# Altium schematic sheet RFA433.SchDoc
size 420 x 297 mm; SheetNumber: 1; SheetTotal: 1
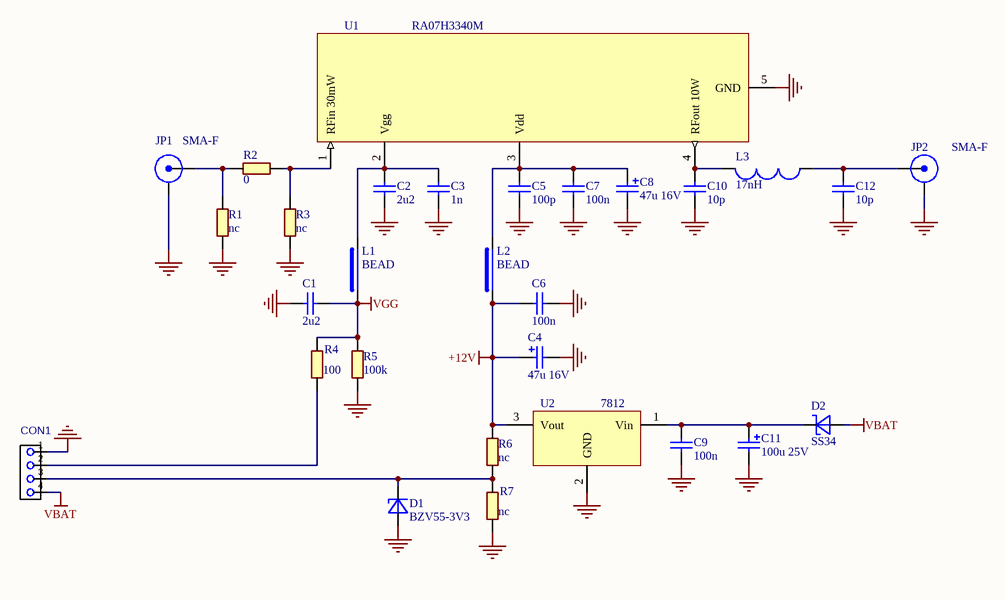
[diagram p0: RFA433.SchDoc]

## Parts
C1  2u2  [C-0805]
C2  2u2  [C-0805]
C3  1n  [C-0805]
C4  47u 16V  [ECAPSMD6377]
C5  100p  [C-0805]
C6  100n  [C-0805]
C7  100n  [C-0805]
C8  47u 16V  [ECAPSMD6377]
C9  100n  [C-0805]
C10  10p  [C-0805]
C11  100u 25V  [ECAPSMD6377]
C12  10p  [C-0805]
CON1  KLS2-301-5.0-04P  [KLS2-301-5.0-04P]  (value not drawn)
D1  BZV55-3V3  [SOD-80_NUM]
D2  SS34  [D_SMC]
JP1  SMA-F  [AMPHENOL_132357-11]
JP2  SMA-F  [AMPHENOL_132357-11]
L1  BEAD  [R-1206]
L2  BEAD  [R-1206]
L3  17nH  [2.75TD3.0W0.7_SMD]
R1  nc  [R-0805]
R2  0  [R-0805]
R3  nc  [R-0805]
R4  100  [R-0805]
R5  100k  [R-0805]
R6  nc  [R-0805]
R7  nc  [R-0805]
U1  RA07H3340M  [H46]
U2  7812  [TO-220/HOR_FLAT]

## Nets
+12V: C4.1 C6.1 L2.1 R6.2 U2.3(Vout)
GND: C1.1 C2.2 C3.2 C4.2 C5.2 C6.2 C7.2 C8.2 C9.1 C10.2 C11.2 C12.2 CON1.1 D1.1 JP1.2(Y) JP2.2(Y) R1.1 R3.1 R5.1 R7.1 U1.5(GND) U2.2(GND)
VBAT: CON1.4 D2.1
VGG: C1.2 L1.1 R4.2 R5.2
NetC2_1: C2.1 C3.1 L1.2 U1.2(Vgg)
NetC5_1: C5.1 C7.1 C8.1 L2.2 U1.3(Vdd)
NetC9_2: C9.2 C11.1 D2.2 U2.1(Vin)
NetC10_1: C10.1 L3.2 U1.4(RFout_10W)
NetC12_1: C12.1 JP2.1(X) L3.1
NetCON1_2: CON1.2 R4.1
NetCON1_3: CON1.3 D1.2 R6.1 R7.2
NetJP1_1: JP1.1(X) R1.2 R2.1
NetR2_2: R2.2 R3.2 U1.1(RFin_30mW)

## Notes on the sheet
- Перв. примен.
- Справ. №
- Подп. и дата
- Инв. № дубл.
- Взам. инв. №
- Изм.
- Лист
- № докум.
- Подп.
- Дата
- Лит.
- Масса
- Масштаб
- Т.контр.
- Пров.
- Разраб.
- Листов
- Инв. № подл.
- Н.контр.
- Утв.
- Копировал
- Формат А3

## Library data of the parts
C1-C3 C5-C7 C9 C10 C12 = CAPN: Voltage: 50V; Точність/група: NP0; Вид: Конденсатор
C4 C8 = CAPP_1: Вид: Конденсатор; Voltage: 16V
C11 = CAPP_1: Voltage: 16V; Вид: Конденсатор
D1 = DIODZ: Вид: Стабілітрон
D2 = DIODSH: Вид: Діод
JP1 JP2 = RF connector: Вид: Роз'єм; *: *
L1 L2 = BEAD: Вид: Ferrite bead
L3 = L: Вид: Індуктивність
R1-R7 = RES: Точність/група: 5%; Вид: Резистор
U1 = RA07H3340M: RF pwer amplifier; Производитель: *; Допустимая замена: *; Цена: *; PDF файл: *; Температурный диапазон: *
U2 = 7805: 12V voltage regulator; Вид: Мікросхема
CON1 = KLS2-301-5.0-04P: Value: *